# EAGLE design Koroliov_v2 (EAGLE 6.4)
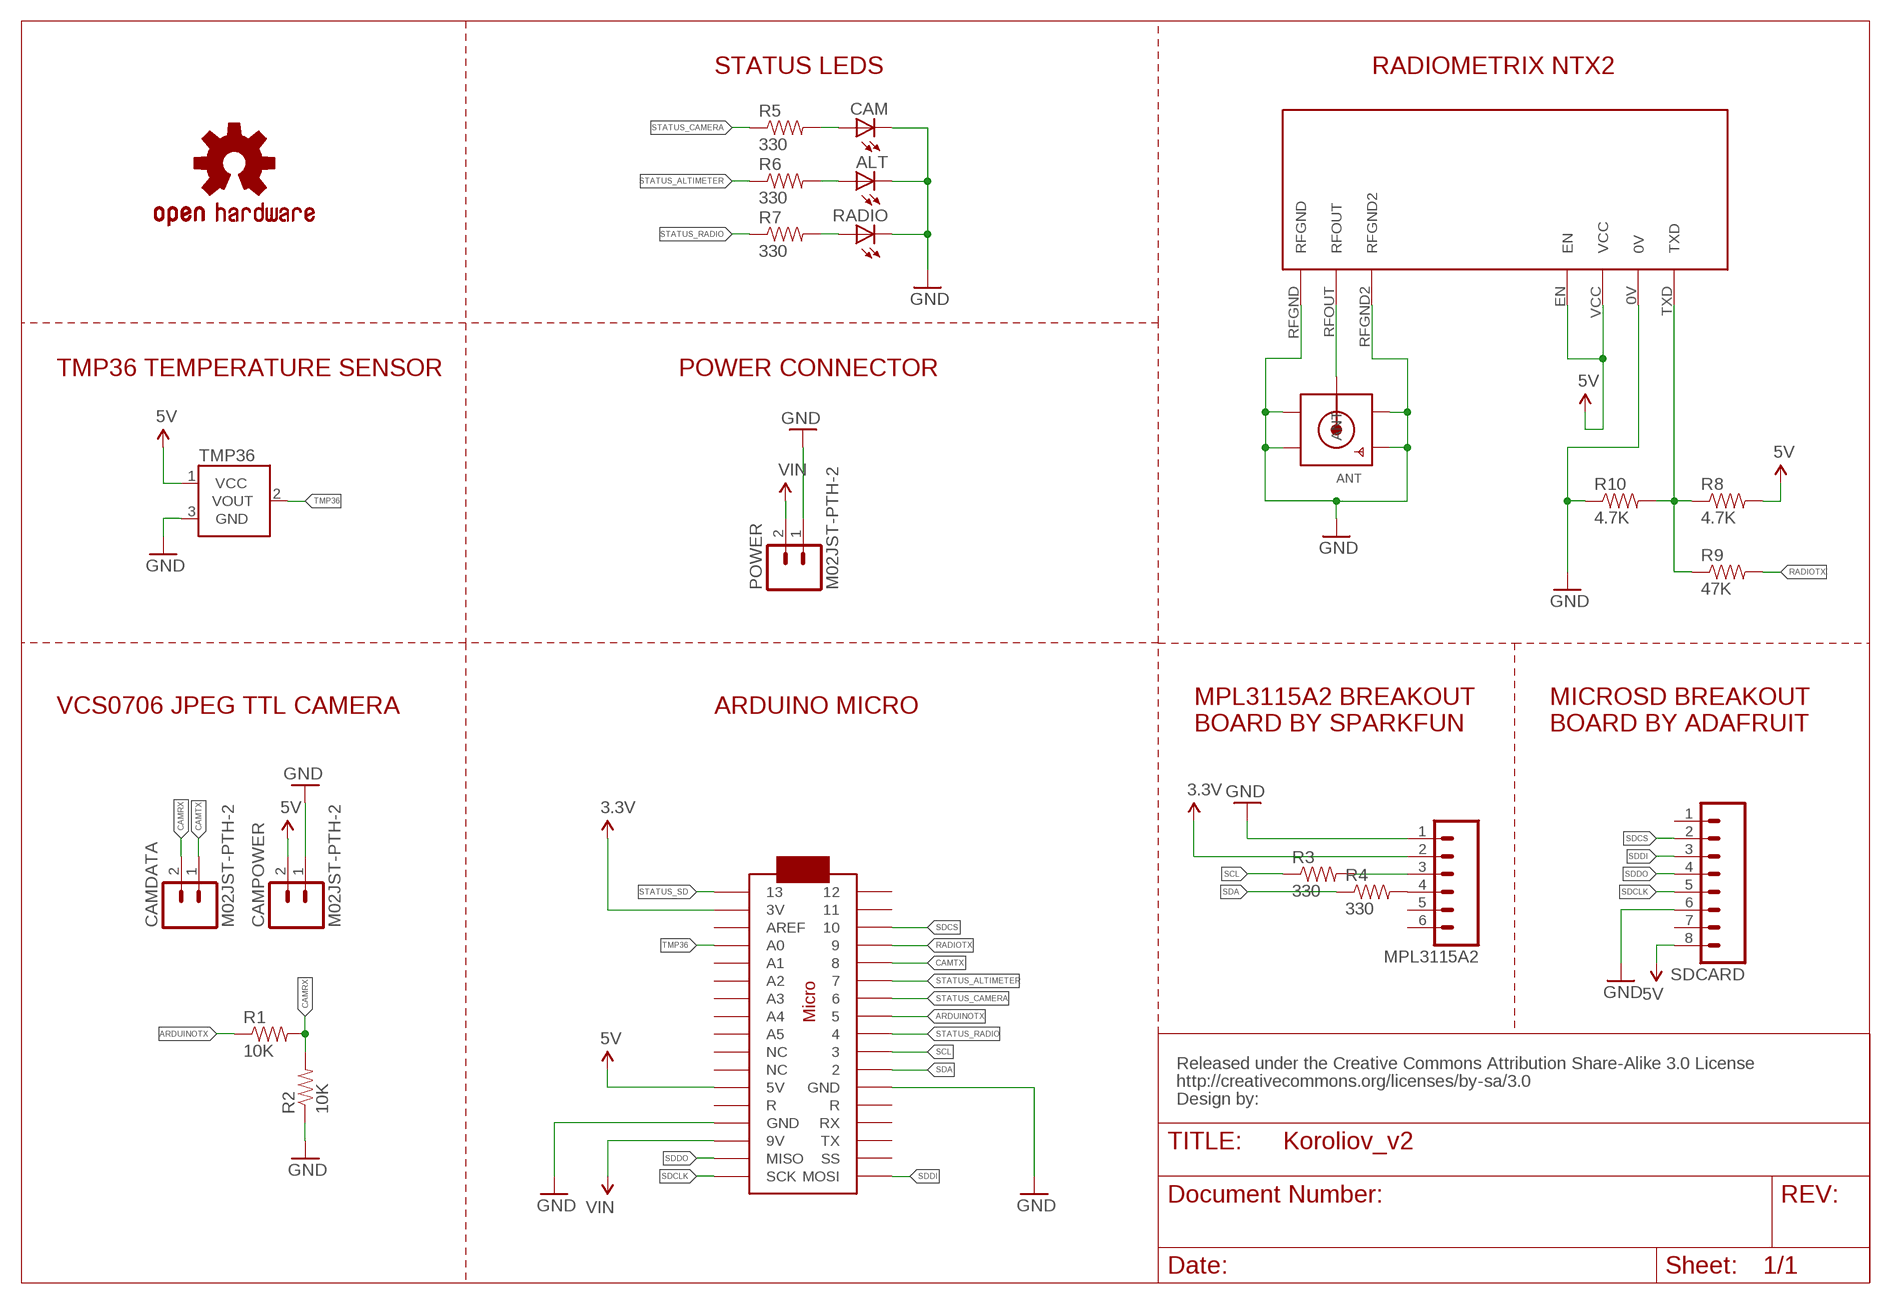
[diagram p0: schematic, sheet 1]

## Parts
ALT  LED1206  [LED-1206]
ANT  SMACONNECTOR_EDGE  [SMA_EDGELAUNCH]
ARDUINOMICRO  ARDUINOMICRO  [ARDUINOMICRO]
CAM  LED1206  [LED-1206]
CAMDATA  M02JST-PTH-2  [JST-2-PTH]
CAMPOWER  M02JST-PTH-2  [JST-2-PTH]
CC_TEXT1  CREATIVE_COMMONS  [CREATIVE_COMMONS]
LOGO1  OSHW-LOGOL  [OSHW-LOGO-L]
MPL3115A2  M06SIP  [1X06]
NTX2  NTX2  [NTX2]
POWER  M02JST-PTH-2  [JST-2-PTH]
R1  10K  RESISTOR1206  [1206]
R2  10K  RESISTOR1206  [1206]
R3  330  RESISTOR1206  [1206]
R4  330  RESISTOR1206  [1206]
R5  330  RESISTOR1206  [1206]
R6  330  RESISTOR1206  [1206]
R7  330  RESISTOR1206  [1206]
R8  4.7K  RESISTOR1206  [1206]
R9  47K  RESISTOR1206  [1206]
R10  4.7K  RESISTOR1206  [1206]
RADIO  LED1206  [LED-1206]
SDCARD  M081X08  [1X08]
TMP36  TMP36GT9  [TO-92]

## Nets
3.3V: ARDUINOMICRO.P$33(3V) MPL3115A2.2
5V: ARDUINOMICRO.P$23(5V) CAMPOWER.2 NTX2.EN NTX2.VCC R8.2 SDCARD.8 TMP36.1(VCC)
ARDUINOTX: ARDUINOMICRO.P$8 R1.1
CAMRX: CAMDATA.2 R1.2 R2.2
CAMTX: ARDUINOMICRO.P$5 CAMDATA.1
GND: ALT.C ANT.GND@1(GND4) ANT.GND@2(GND3) ANT.GND@3(GND2) ANT.GND@4(GND1) ARDUINOMICRO.P$12(GND) ARDUINOMICRO.P$21(GND) CAM.C CAMPOWER.1 MPL3115A2.1 NTX2.0V NTX2.RFGND NTX2.RFGND2 POWER.1 R2.1 R10.1 RADIO.C SDCARD.6 TMP36.3(GND)
N$1: ANT.P(ANT) NTX2.RFOUT
N$2: CAM.A R5.2
N$3: ALT.A R6.2
N$4: MPL3115A2.3 R3.2
N$5: MPL3115A2.4 R4.2
N$6: R7.2 RADIO.A
N$7: NTX2.TXD R8.1 R9.1 R10.2
RADIOTX: ARDUINOMICRO.P$4 R9.2
SCL: ARDUINOMICRO.P$10 R3.1
SDA: ARDUINOMICRO.P$11 R4.1
SDCLK: ARDUINOMICRO.P$18(SCK) SDCARD.5
SDCS: ARDUINOMICRO.P$3 SDCARD.2
SDDI: ARDUINOMICRO.P$17(MOSI) SDCARD.3
SDDO: ARDUINOMICRO.P$19(MISO) SDCARD.4
STATUS_ALTIMETER: ARDUINOMICRO.P$6 R6.1
STATUS_CAMERA: ARDUINOMICRO.P$7 R5.1
STATUS_RADIO: ARDUINOMICRO.P$9 R7.1
STATUS_SD: ARDUINOMICRO.P$34
TMP36: ARDUINOMICRO.P$31(A0) TMP36.2(VOUT)
VIN: ARDUINOMICRO.P$20(9V) POWER.2
Unconnected: ARDUINOMICRO.P$1 ARDUINOMICRO.P$2 ARDUINOMICRO.P$13(R) ARDUINOMICRO.P$14(RX) ARDUINOMICRO.P$15(TX) ARDUINOMICRO.P$16(SS) ARDUINOMICRO.P$22(R) ARDUINOMICRO.P$24(NC) ARDUINOMICRO.P$25(NC) ARDUINOMICRO.P$26(A5) ARDUINOMICRO.P$27(A4) ARDUINOMICRO.P$28(A3) ARDUINOMICRO.P$29(A2) ARDUINOMICRO.P$30(A1) ARDUINOMICRO.P$32(AREF) MPL3115A2.5 MPL3115A2.6 SDCARD.1 SDCARD.7

## Notes on the sheet
- STATUS LEDS | RADIOMETRIX NTX2
- TMP36 TEMPERATURE SENSOR | POWER CONNECTOR
- VCS0706 JPEG TTL CAMERA | ARDUINO MICRO
- MPL3115A2 BREAKOUT
  BOARD BY SPARKFUN
- MICROSD BREAKOUT
  BOARD BY ADAFRUIT

## Library data of the parts
ALT CAM RADIO = SparkFun-LED:LED: LEDs Standard schematic elements and footprints for 5mm, 3mm, 1206, and 0603 sized LEDs. 5mm - Spark Fun Electronics SKU : COM-00529 (and others)
ANT = adafruit:SMACONNECTOR: SMA Connector 90° DIP SMA Connector, 50 Ohm (4UConnector: 07259)
ARDUINOMICRO = adafruit:ARDUINOMICRO
CAMDATA CAMPOWER POWER = SparkFun-Connectors:M02: Standard 2-pin 0.1" header. Use with - straight break away headers ( PRT-00116) - right angle break away headers (PRT-00553) - swiss pins (PRT-00743) - machine pins (PRT-00117) - female headers (PRT-00115) Molex polarized connector foot print use with: PRT-08233 with associated crimp pins and housings. 2.54_SCREWTERM for use with PRT-10571. 3.5mm Screw Terminal footprints for PRT-08084 5mm Screw Terminal footprints for use with PRT-08433
CC_TEXT1 = SparkFun-Aesthetics:CREATIVE_COMMONS: Creative Commons License summary
LOGO1 = SparkFun-Aesthetics:OSHW-LOGO: Open Source Hardware Logo This logo indicates the piece of hardware it is found on incorporates a OSHW license and/or adheres to the definition of open source hardware found here: http://freedomdefined.org/OSHW
MPL3115A2 = SparkFun-Connectors:M06: Header 6 Standard 6-pin 0.1" header. Use with straight break away headers (SKU : PRT-00116), right angle break away headers (PRT-00553), swiss pins (PRT-00743), machine pins (PRT-00117), and female headers (PRT-00115). Molex polarized connector foot print use with SKU : PRT-08094 with associated crimp pins and housings. NOTES ON THE VARIANTS LOCK and LOCK_LONGPADS... This footprint was designed to help hold the alignment of a through-hole component (i.e. 6-pin header) while soldering it into place. You may notice that each hole has been shifted either up or down by 0.005 of an inch from it's more standard position (which is a perfectly straight line). This slight alteration caused the pins (the squares in the middle) to touch the edges of the holes. Because they are alternating, it causes a "brace" to hold the component in place. 0.005 has proven to be the perfect amount of "off-center" position when using our standard breakaway headers. Although looks a little odd when you look at the bare footprint, once you have a header in there, the alteration is very hard to notice. Also, if you push a header all the way into place, it is covered up entirely on the bottom side. This idea of altering the position of holes to aid alignment will be further integrated into the Sparkfun Library for other footprints. It can help hold any component with 3 or more connection pins.
NTX2 = Ava:NTX2: Radiometrix NTX2 Transmitter Module Author Anthony Stirk / http://ava.upuaut.net
R1-R10 = SparkFun-Passives:RESISTOR: Resistor Basic schematic elements and footprints for 0603, 1206, and PTH resistors.
SDCARD = SparkFun-Connectors:M08: Header 8 Standard 8-pin 0.1" header. Use with straight break away headers (SKU : PRT-00116), right angle break away headers (PRT-00553), swiss pins (PRT-00743), machine pins (PRT-00117), and female headers (PRT-00115).
TMP36 = SparkFun-Sensors:TMP36: Precision degC temp sensor, analog out

## Board
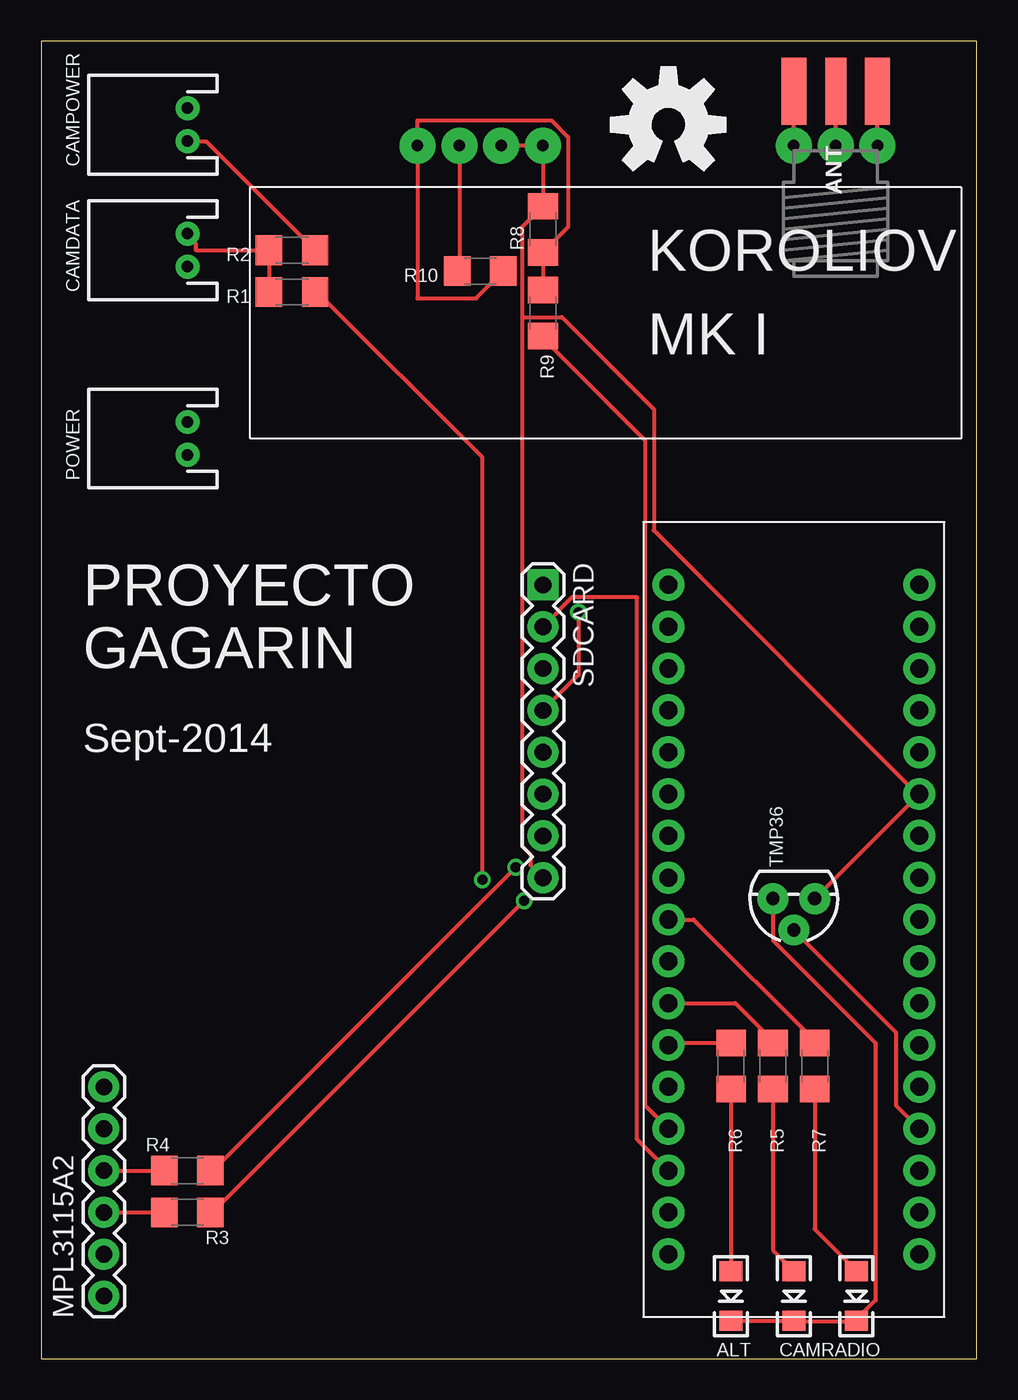
[diagram p1: board, top side]
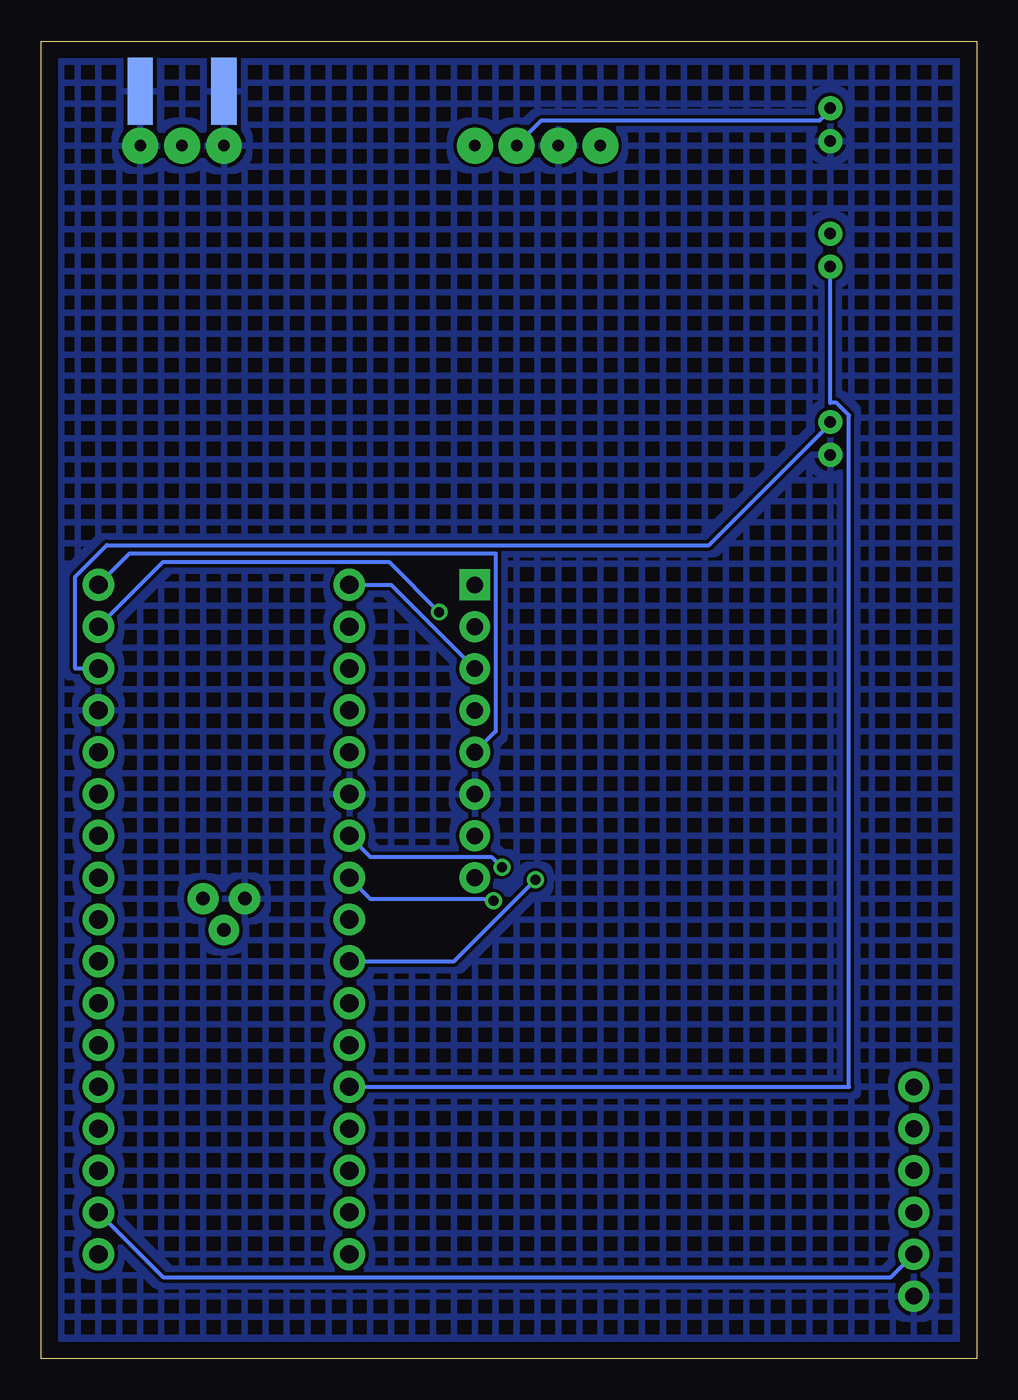
[diagram p2: board, bottom side, seen from below]

Size 56.82 x 80 mm. Coordinates in mm from the lower left corner, seen from the top.
Outline: 0,0 56.82,0 56.82,80 0,80 0,0
Copper layers (1*16): Top 0.035mm / dielectric 1.5mm / Bottom 0.035mm
Design rules "default": minimum track width 10mil, minimum drill 24mil, track to track 8mil, track to pad 8mil, pad to pad 8mil, via to via 8mil, smd to smd 8mil, copper to edge 40mil, drill to drill 8mil, minimum pad ring 10mil, minimum via ring 8mil, stop-mask expansion 4mil, vias tented up to drill 0mil, thermal gap 10mil

### Footprints (pad centres in the part's own frame; a part is rotated, then mirrored left to right if it is on the bottom)
LED-1206 = smd 1.2 x 1.4: A -1.5,0; C 1.5,0
SMA_EDGELAUNCH = smd 4.064 x 1.524: GND@1 2.032,-2.54; GND@2 2.032,2.54 | smd 4.064 x 1.524 bottom: GND@3 2.032,2.54; GND@4 2.032,-2.54 | smd 4.064 x 1.27: P 2.032,0
ARDUINOMICRO = drill 1.1 pad 1.93: P$1 -20.32,7.62; P$2 -17.78,7.62; P$3 -15.24,7.62; P$4 -12.7,7.62; P$5 -10.16,7.62; P$6 -7.62,7.62; P$7 -5.08,7.62; P$8 -2.54,7.62; P$9 0,7.62; P$10 2.54,7.62; P$11 5.08,7.62; P$12 12.7,-7.62; P$13 10.16,-7.62; P$14 12.7,7.62; P$15 15.24,7.62; P$16 17.78,7.62; P$17 20.32,7.62; P$18 20.32,-7.62; P$19 17.78,-7.62; P$20 15.24,-7.62; P$21 7.62,7.62; P$22 10.16,7.62; P$23 7.62,-7.62; P$24 5.08,-7.62; P$25 2.54,-7.62; P$26 0,-7.62; P$27 -2.54,-7.62; P$28 -5.08,-7.62; P$29 -7.62,-7.62; P$30 -10.16,-7.62; P$31 -12.7,-7.62; P$32 -15.24,-7.62; P$33 -17.78,-7.62; P$34 -20.32,-7.62
JST-2-PTH = drill 0.7 pad 1.448: 1 -1,0; 2 1,0
1X06 = drill 1.016 pad 1.88: 1 0,0; 2 2.54,0; 3 5.08,0; 4 7.62,0; 5 10.16,0; 6 12.7,0
NTX2 = drill 0.7 pad 2.184: 0V -2.54,-10.16; EN -7.62,-10.16; RFGND -22.86,-10.16; RFGND2 -27.94,-10.16; RFOUT -25.4,-10.16; TXD 0,-10.16; VCC -5.08,-10.16
1206 = smd 1.6 x 1.8: 1 -1.4,0; 2 1.4,0
1X08 = drill 1.016 pad 1.88 square: 1 0,0 | drill 1.016 pad 1.88: 2 2.54,0; 3 5.08,0; 4 7.62,0; 5 10.16,0; 6 12.7,0; 7 15.24,0; 8 17.78,0
TO-92 = drill 0.813 pad 1.88: 1 -1.27,0; 2 0,1.905; 3 1.27,0

### Placement (x,y rotation side)
ALT  41.91,3.81 270 top
ANT  48.26,74.93 90 top
ARDUINOMICRO  45.72,26.67 90 top
CAM  45.72,3.81 270 top
CAMDATA  8.89,67.31 90 top
CAMPOWER  8.89,74.93 90 top
CC_TEXT1  0,0 0 top
LOGO1  38.1,74.93 0 top
MPL3115A2  3.81,3.81 90 top
NTX2  22.86,63.5 180 top
POWER  8.89,55.88 90 top
R1  15.24,64.77 180 top
R2  15.24,67.31 180 top
R3  8.89,8.89 180 top
R4  8.89,11.43 180 top
R5  44.45,17.78 270 top
R6  41.91,17.78 270 top
R7  46.99,17.78 270 top
R8  30.48,68.58 90 top
R9  30.48,63.5 270 top
R10  26.67,66.04 0 top
RADIO  49.53,3.81 270 top
SDCARD  30.48,46.99 270 top
TMP36  45.72,27.94 180 top

### Tracks (layer width: path | path; a pad name or v marks a point on that pad's centre or on a via)
3.3V
  Bottom 0.254: MPL3115A2.2 5.21,4.95 49.4,4.95 ARDUINOMICRO.P$33
5V
  Top 0.254: TMP36.1 ARDUINOMICRO.P$23 53.21,34.29 37.21,50.29 37.21,57.66 31.62,63.25 29.21,63.25 | SDCARD.8 29.72,29.97 29.72,30.61 29.21,31.11 29.21,63.25 | 29.21,63.25 29.21,68.71 R8.2 NTX2.EN NTX2.VCC
  Bottom 0.254: NTX2.VCC 26.42,75.18 9.53,75.18 8.89,75.82 CAMPOWER.2
ARDUINOTX  (via drill 0.61)
  Top 0.254: v26.8,29.08 26.8,54.74 16.76,64.77 R1.1
  Bottom 0.254: v26.8,29.08 31.75,24.13 ARDUINOMICRO.P$8
CAMRX
  Top 0.254: R1.2 R2.2 9.4,67.31 9.4,67.69 8.89,68.2 CAMDATA.2
CAMTX
  Bottom 0.254: CAMDATA.1 8.89,58.04 8.51,58.04 7.75,57.28 7.75,16.51 ARDUINOMICRO.P$5
GND
  Top 0.254: 45.72,2.29 41.91,2.29 ALT.C | 45.72,2.29 49.53,2.29 RADIO.C 49.53,2.41 50.67,3.56 50.67,19.18 44.45,25.4 TMP36.3 | 45.72,2.29 CAM.C | R2.1 10.03,73.91 8.89,73.91 CAMPOWER.1 | NTX2.0V 25.4,66.17 R10.1 | NTX2.RFGND ANT.GND@3 | NTX2.RFGND2 ANT.GND@4
  pour Bottom (hatched): 0,0 57.15,0 57.15,80.01 0,80.01
N$1
  Top 0.254: NTX2.RFOUT ANT.P
N$2
  Top 0.254: R5.2 44.45,6.6 45.72,5.33 CAM.A
N$3
  Top 0.254: R6.2 ALT.A
N$4
  Top 0.254: MPL3115A2.3 R3.2
N$5
  Top 0.254: MPL3115A2.4 R4.2
N$6
  Top 0.254: R7.2 46.99,7.87 49.53,5.33 RADIO.A
N$7
  Top 0.254: R9.1 R8.1 32,68.71 32,74.17 30.99,75.18 22.86,75.18 NTX2.TXD 22.86,64.39 26.42,64.39 R10.2
RADIOTX
  Top 0.254: ARDUINOMICRO.P$4 36.7,15.37 36.7,55.75 30.48,61.98 R9.2
SCL  (via drill 0.61)
  Top 0.254: v29.34,27.81 10.41,8.89 R3.1
  Bottom 0.254: v29.34,27.81 29.46,27.94 36.83,27.94 ARDUINOMICRO.P$10
SDA  (via drill 0.61)
  Top 0.254: v28.83,29.84 10.41,11.43 R4.1
  Bottom 0.254: v28.83,29.84 29.46,30.48 36.83,30.48 ARDUINOMICRO.P$11
SDCLK
  Bottom 0.254: SDCARD.5 29.21,38.1 29.21,48.9 51.44,48.9 ARDUINOMICRO.P$18
SDCS
  Top 0.254: SDCARD.2 32.26,46.23 36.2,46.23 36.2,13.34 ARDUINOMICRO.P$3
SDDI
  Bottom 0.254: SDCARD.3 35.56,46.99 ARDUINOMICRO.P$17
SDDO  (via drill 0.61)
  Top 0.254: SDCARD.4 32.64,41.53 v32.64,45.34
  Bottom 0.254: v32.64,45.34 35.69,48.39 49.4,48.39 ARDUINOMICRO.P$19
STATUS_ALTIMETER
  Top 0.254: ARDUINOMICRO.P$6 38.1,19.18 R6.1
STATUS_CAMERA
  Top 0.254: ARDUINOMICRO.P$7 42.16,21.59 44.45,19.3 R5.1
STATUS_RADIO
  Top 0.254: ARDUINOMICRO.P$9 39.62,26.67 46.99,19.3 R7.1
TMP36
  Top 0.254: TMP36.2 51.94,19.81 51.94,15.37 ARDUINOMICRO.P$31
VIN
  Bottom 0.254: ARDUINOMICRO.P$20 54.74,41.91 54.74,47.5 52.83,49.4 16.26,49.4 8.89,56.77 POWER.2

### Text on the board
_tsilk: KOROLIOV | MK I | PROYECTO | GAGARIN | Sept-2014